# Altium schematic sheet WIFI_killer.SchDoc
size A4
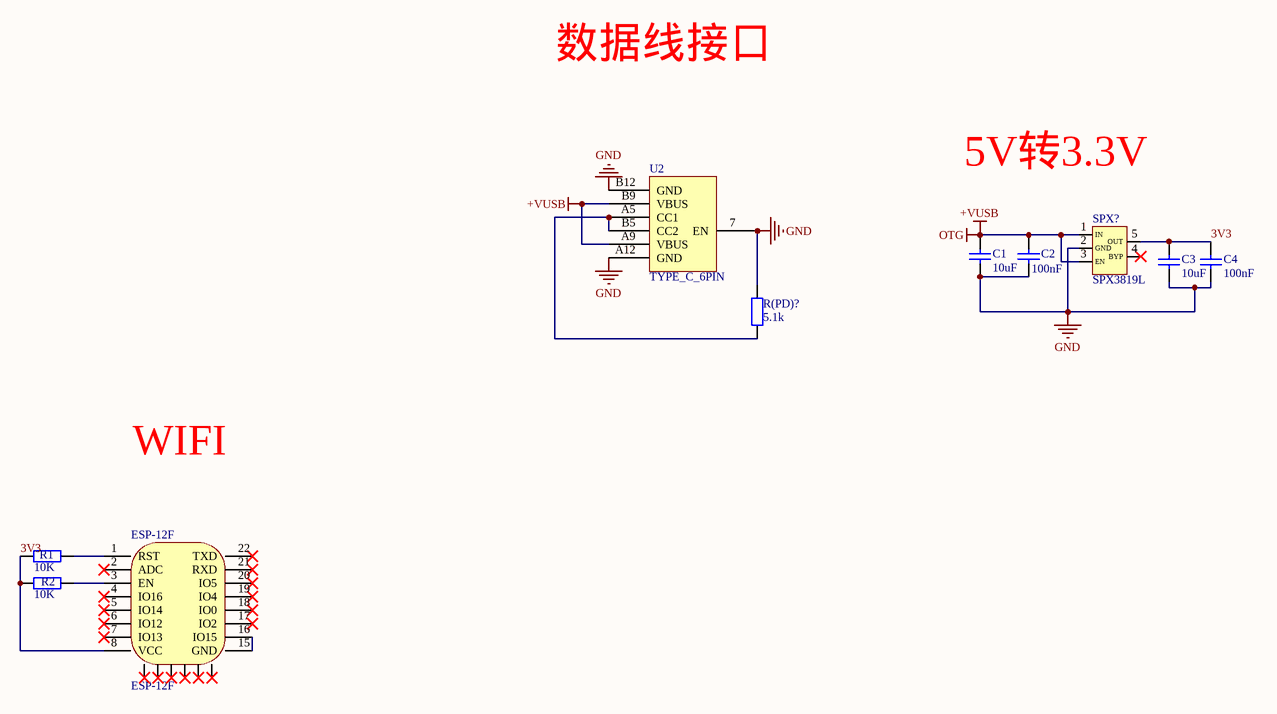
[diagram p0: WIFI_killer.SchDoc]

## Parts
C1  10uF  [0603 电容]
C2  100nF  [0603 电容]
C3  10uF  [0603 电容]
C4  100nF  [0603 电容]
ESP-12F  ESP-12F  [ESP-12F]
R1  10K  [0603 电阻]
R2  10K  [0603 电阻]
R(PD)?  5.1k  [0603 电阻]
SPX?  SPX3819L  [SPX3819]
U2  TYPE_C_6PIN  [TYPE_C_PIN]

## Nets
+VUSB: C1.2 C2.2 SPX?.1(IN) SPX?.3(EN) U2.A9(VBUS) U2.B9(VBUS)  [also labelled OTG]
GND: C1.1 C2.1 C3.1 C4.1 R(PD)?.2 SPX?.2(GND) U2.7(EN) U2.A12(GND) U2.B12(GND)
3V3: C3.2 C4.2 ESP-12F.8(VCC) R1.1 R2.1 SPX?.5(OUT)
NetESP-12F_1: ESP-12F.1(RST) R1.2
NetESP-12F_3: ESP-12F.3(EN) R2.2
NetESP-12F_15: ESP-12F.15(GND) ESP-12F.16(IO15)
NetR(PD)?_1: R(PD)?.1 U2.A5(CC1) U2.B5(CC2)

Not connected (* = marked no-connect by the designer): ESP-12F 2(ADC)* 4(IO16)* 5(IO14)* 6(IO12)* 7(IO13)* 9* 10* 11* 12* 13* 14* 17(IO2)* 18(IO0)* 19(IO4)* 20(IO5)* 21(RXD)* 22(TXD)*; SPX? 4(BYP)*

## Notes on the sheet
- 数据线接口
- 5V转3.3V
- WIFI

## Library data of the parts
C1-C4 = 电容 无极
R1 R2 R(PD)? = 电阻
SPX? = SPX3819LM